# EAGLE design PracticalArduino_ProtoShieldPro (EAGLE 5.06)
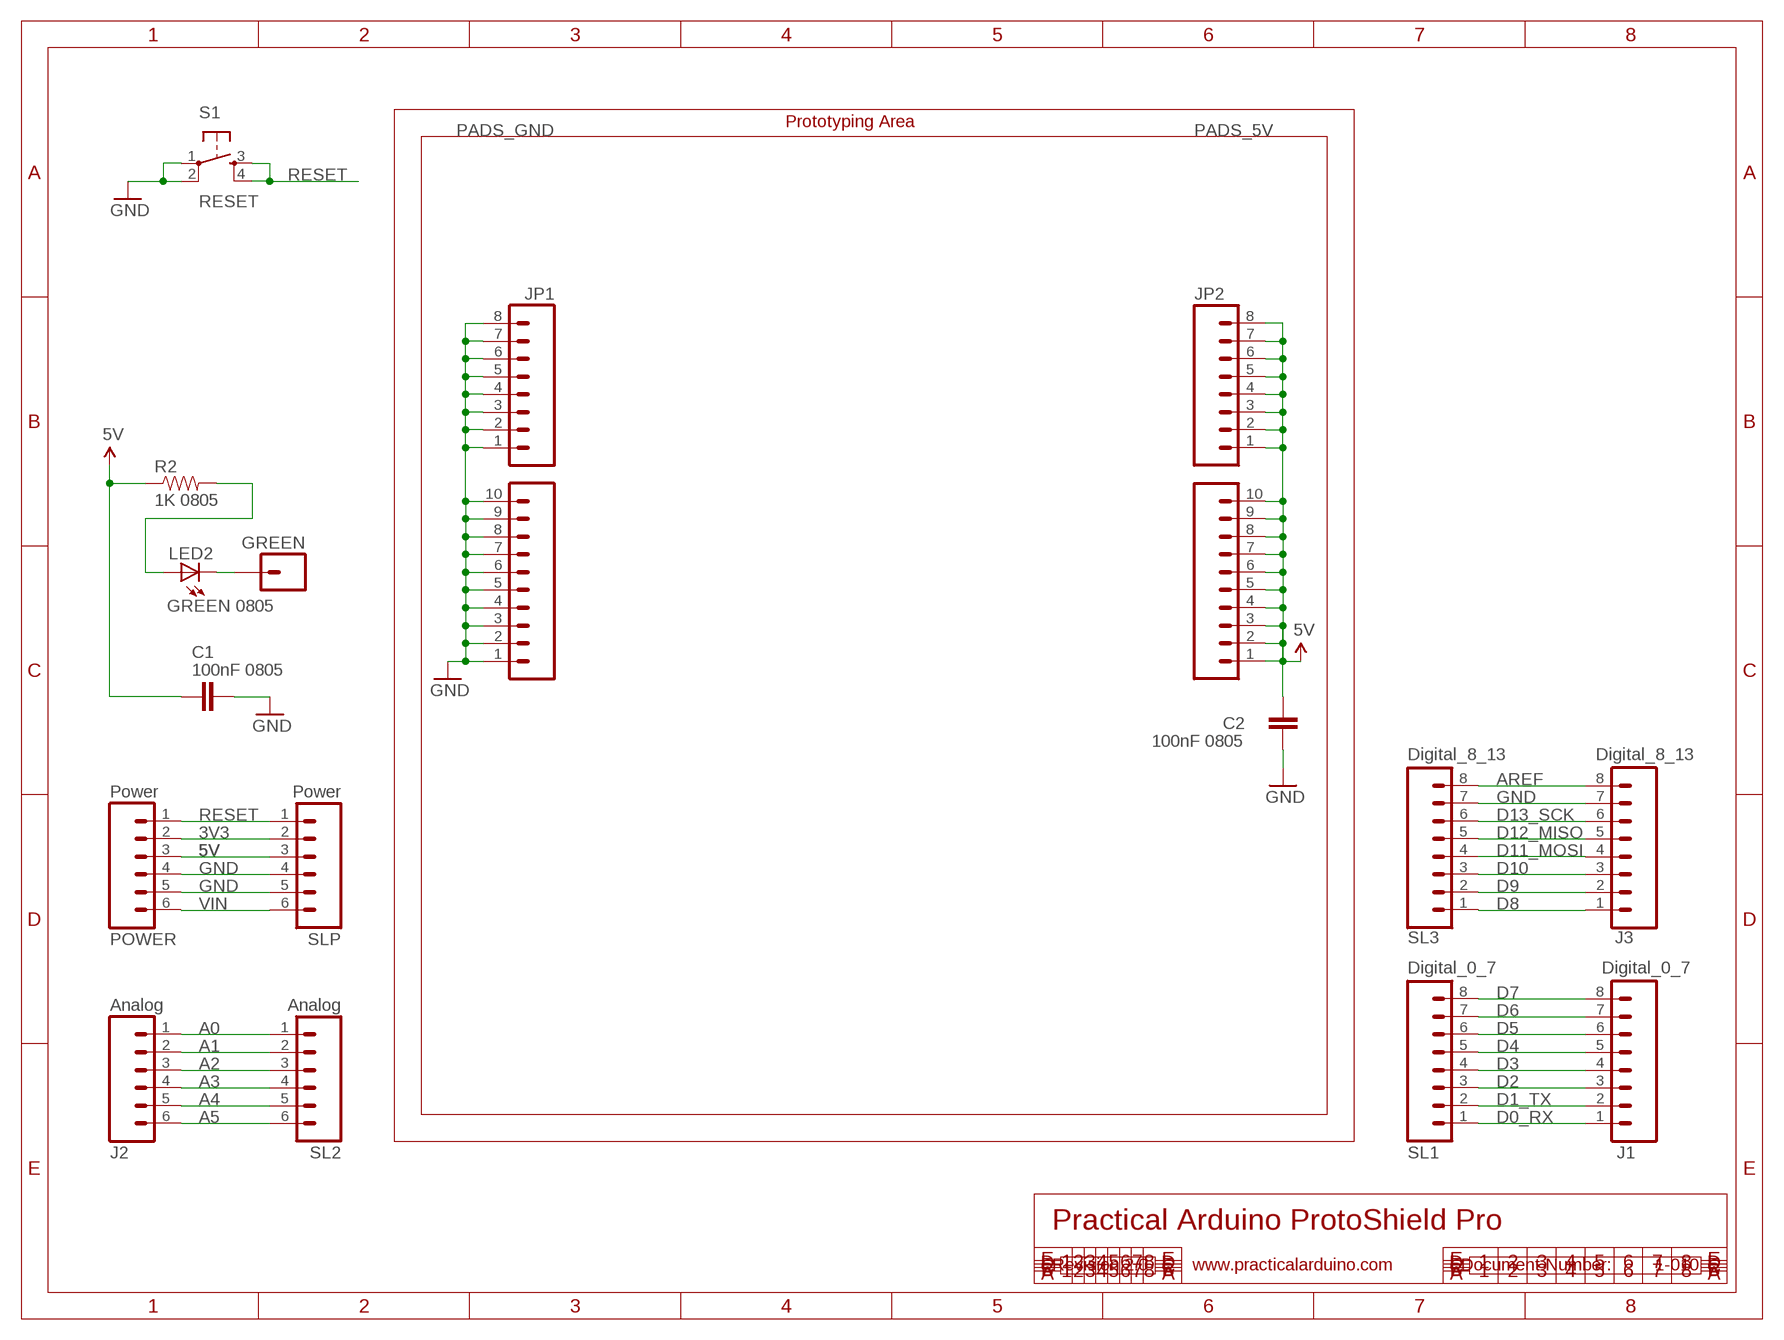
[diagram p0: schematic, sheet 1]

## Parts
C1  100nF 0805  CAP0805-LARGE  [0805-LARGE]
C2  100nF 0805  CAP0805-LARGE  [0805-LARGE]
GREEN  M01PTH  [1X01]
J1  Digital_0_7  M08  [1X08]
J2  Analog  M06SIP  [1X06]
J3  Digital_8_13  M08  [1X08]
JP1  M08  [1X08]
JP2  M08  [1X08]
LED2  GREEN 0805  LED0805-LARGE  [LED-0805-LARGE]
PADS_5V  M100.1  [1X10]
PADS_GND  M100.1  [1X10]
POWER  Power  M06SIP  [1X06]
R2  1K 0805  RESISTOR0805-LARGE  [0805-LARGE]
S1  RESET  TAC_SWITCHPTH  [TACTILE-PTH]
SL1  Digital_0_7  M08  [1X08]
SL2  Analog  M06SIP  [1X06]
SL3  Digital_8_13  M08  [1X08]
SLP  Power  M06SIP  [1X06]

## Nets
3V3: POWER.2 SLP.2
5V: C1.1 C2.1 JP2.1 JP2.2 JP2.3 JP2.4 JP2.5 JP2.6 JP2.7 JP2.8 PADS_5V.1 PADS_5V.2 PADS_5V.3 PADS_5V.4 PADS_5V.5 PADS_5V.6 PADS_5V.7 PADS_5V.8 PADS_5V.9 PADS_5V.10 POWER.3 R2.1 SLP.3
A0: J2.1 SL2.1
A1: J2.2 SL2.2
A2: J2.3 SL2.3
A3: J2.4 SL2.4
A4: J2.5 SL2.5
A5: J2.6 SL2.6
AREF: J3.8 SL3.8
D0_RX: J1.1 SL1.1
D1_TX: J1.2 SL1.2
D2: J1.3 SL1.3
D3: J1.4 SL1.4
D4: J1.5 SL1.5
D5: J1.6 SL1.6
D6: J1.7 SL1.7
D7: J1.8 SL1.8
D8: J3.1 SL3.1
D9: J3.2 SL3.2
D10: J3.3 SL3.3
D11_MOSI: J3.4 SL3.4
D12_MISO: J3.5 SL3.5
D13_SCK: J3.6 SL3.6
GND: C1.2 C2.2 J3.7 JP1.1 JP1.2 JP1.3 JP1.4 JP1.5 JP1.6 JP1.7 JP1.8 PADS_GND.1 PADS_GND.2 PADS_GND.3 PADS_GND.4 PADS_GND.5 PADS_GND.6 PADS_GND.7 PADS_GND.8 PADS_GND.9 PADS_GND.10 POWER.4 POWER.5 S1.1 S1.2 SL3.7 SLP.4 SLP.5
N$3: LED2.A R2.2
N$4: GREEN.1 LED2.C
RESET: POWER.1 S1.3 S1.4 SLP.1
VIN: POWER.6 SLP.6

## Notes on the sheet
- Prototyping Area
- Practical Arduino ProtoShield Pro
- Revision 2.0 | www.practicalarduino.com | Document Number: | 1-010

## Library data of the parts
C1 C2 = SparkFun:CAP: Capacitor Standard 0603 ceramic capacitor, and 0.1" leaded capacitor.
GREEN = SparkFun:M01: Header 1 Standard 1-pin 0.1" header. Use with straight break away headers (SKU : PRT-00116), right angle break away headers (PRT-00553), swiss pins (PRT-00743), machine pins (PRT-00117), and female headers (PRT-00115).
J1 J3 JP1 JP2 SL1 SL3 = SparkFun:M08: Header 8 Standard 8-pin 0.1" header. Use with straight break away headers (SKU : PRT-00116), right angle break away headers (PRT-00553), swiss pins (PRT-00743), machine pins (PRT-00117), and female headers (PRT-00115).
J2 POWER SL2 SLP = SparkFun:M06: Header 6 Standard 6-pin 0.1" header. Use with straight break away headers (SKU : PRT-00116), right angle break away headers (PRT-00553), swiss pins (PRT-00743), machine pins (PRT-00117), and female headers (PRT-00115). Molex polarized connector foot print use with SKU : PRT-08094 with associated crimp pins and housings. NOTES ON THE VARIANTS LOCK and LOCK_LONGPADS... This footprint was designed to help hold the alignment of a through-hole component (i.e. 6-pin header) while soldering it into place. You may notice that each hole has been shifted either up or down by 0.005 of an inch from it's more standard position (which is a perfectly straight line). This slight alteration caused the pins (the squares in the middle) to touch the edges of the holes. Because they are alternating, it causes a "brace" to hold the component in place. 0.005 has proven to be the perfect amount of "off-center" position when using our standard breakaway headers. Although looks a little odd when you look at the bare footprint, once you have a header in there, the alteration is very hard to notice. Also, if you push a header all the way into place, it is covered up entirely on the bottom side. This idea of altering the position of holes to aid alignment will be further integrated into the Sparkfun Library for other footprints. It can help hold any component with 3 or more connection pins.
LED2 = SparkFun:LED: LEDs Standard schematic elements and footprints for 5mm, 3mm, 1206, and 0603 sized LEDs. 5mm - Spark Fun Electronics SKU : COM-00529 (and others)
PADS_5V PADS_GND = SparkFun:M10: Header 10 Standard 10-pin 0.1" header. Use with straight break away headers (SKU : PRT-00116), right angle break away headers (PRT-00553), swiss pins (PRT-00743), machine pins (PRT-00117), and female headers (PRT-00115).
R2 = SparkFun:RESISTOR: Resistor Basic schematic elements and footprints for 0603, 1206, and PTH 1/10th watt (small) resistors.
S1 = SparkFun:TAC_SWITCH: Momentary Switch Button commonly used for reset or general input. Spark Fun Electronics SKU : COM-00097

## Board
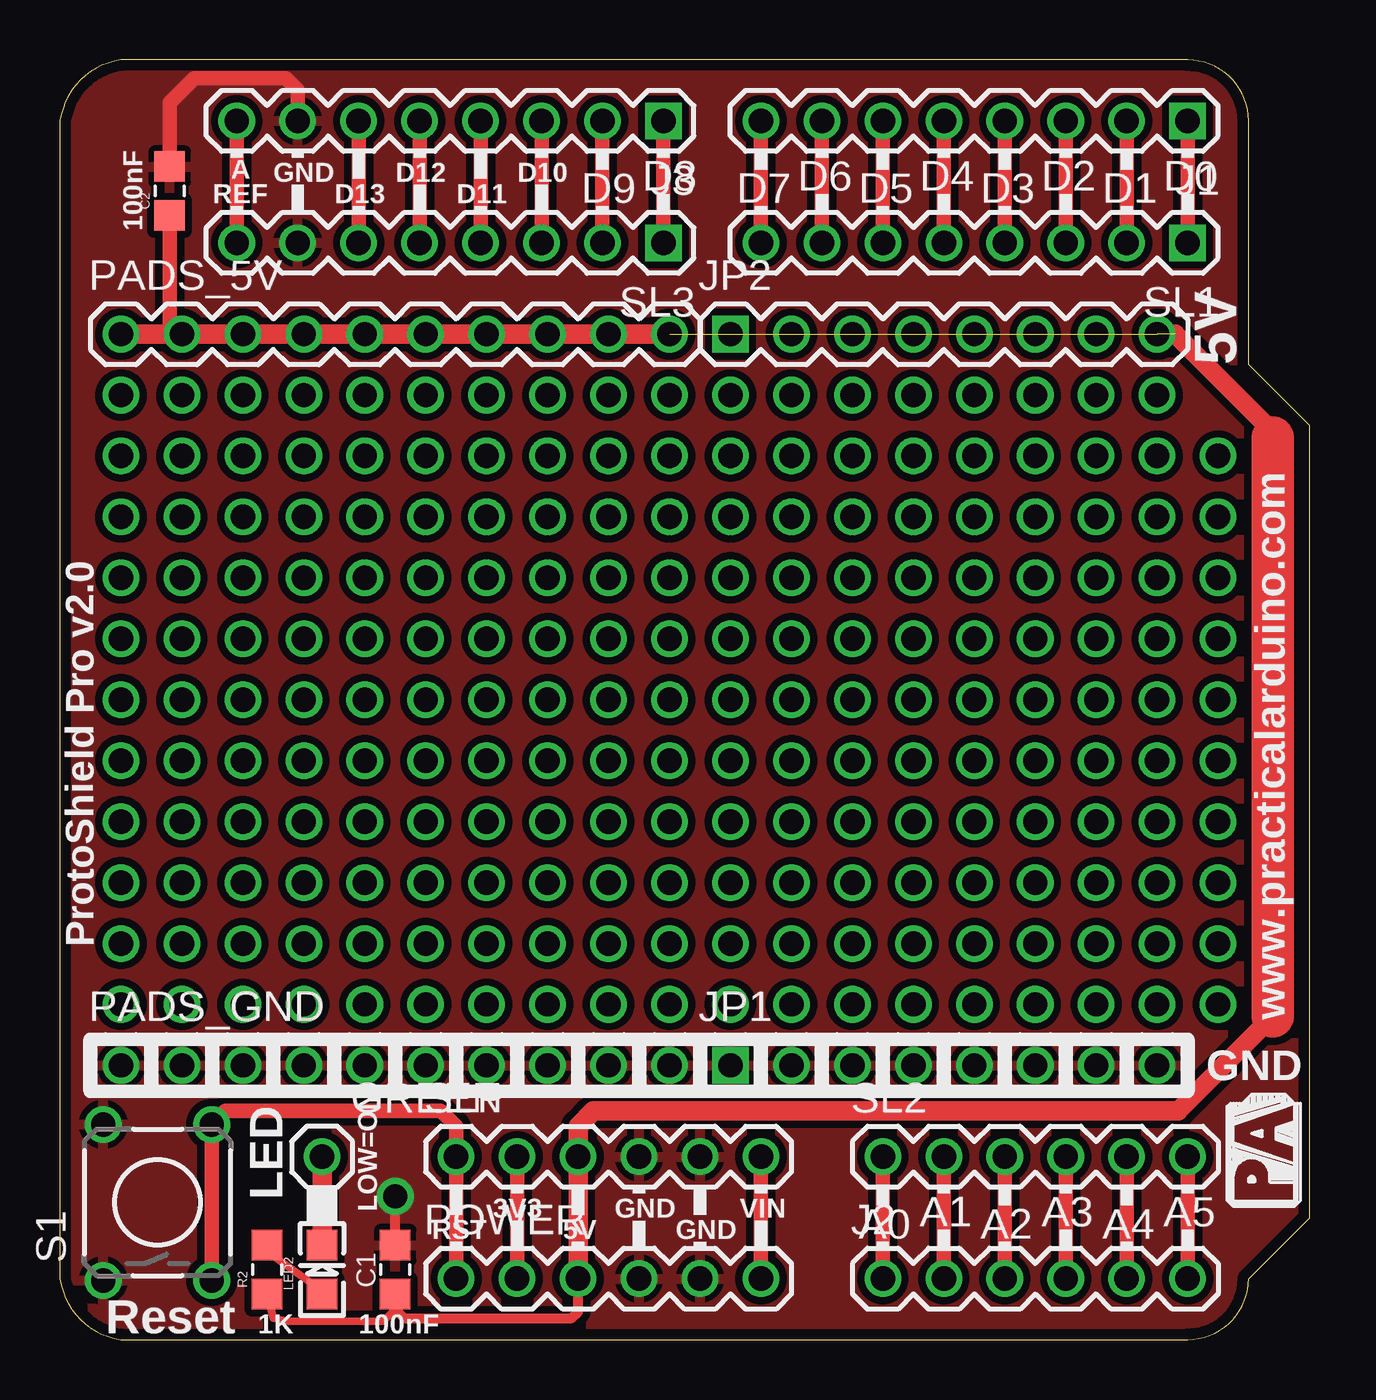
[diagram p1: board, top side]
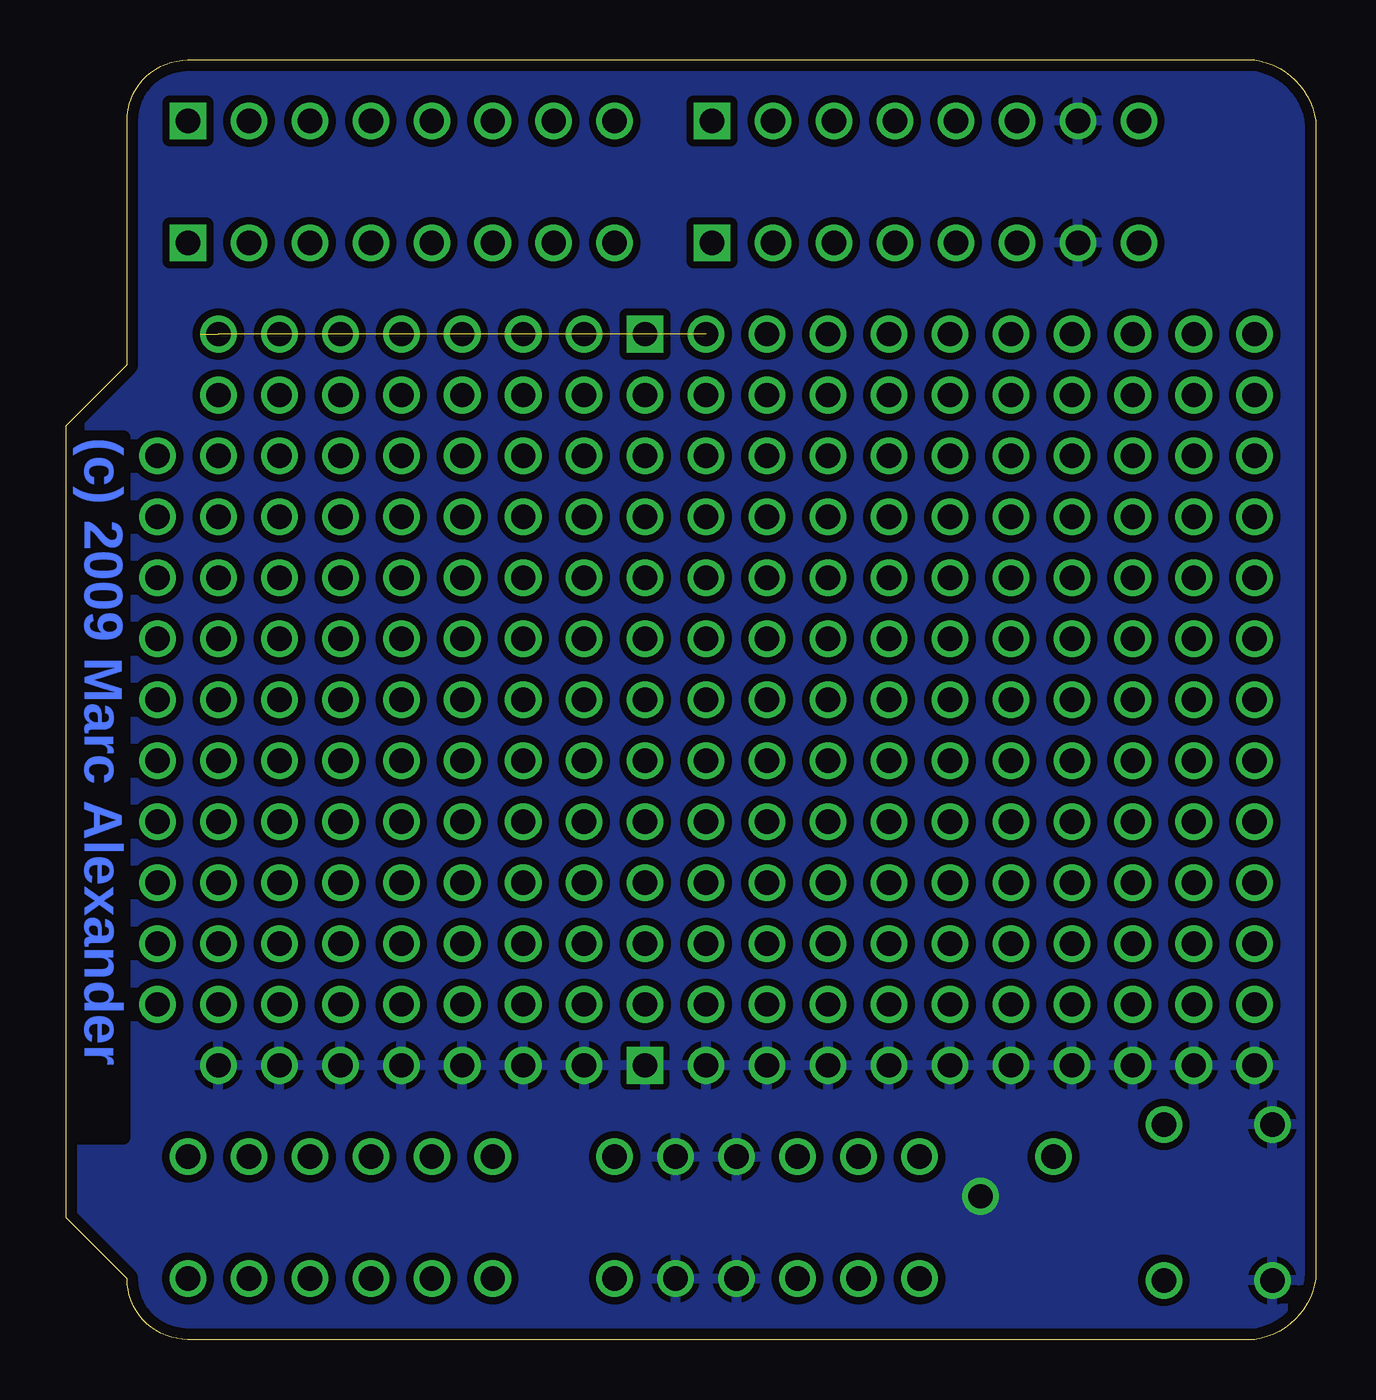
[diagram p2: board, bottom side, seen from below]

Size 52.07 x 53.34 mm. Coordinates in mm from the lower left corner, seen from the top.
Outline: 0,2.54 arc74 2.54,0 46.99,0 arc90 49.53,2.54 52.07,5.08 52.07,38.1 49.53,40.64 49.53,50.8 arc90 46.99,53.34 2.54,53.34 arc74 0,50.8 0,2.54
Copper layers (1*16): Top 0.035mm / dielectric 1.5mm / Bottom 0.035mm
Design rules "default *": minimum track width 10mil, minimum drill 24mil, track to track 12mil, track to pad 12mil, pad to pad 12mil, via to via 12mil, smd to smd 8mil, copper to edge 18mil, drill to drill 8mil, minimum pad ring 10mil, minimum via ring 8mil, stop-mask expansion 4mil, vias tented up to drill 0mil, thermal gap 10mil

### Footprints (pad centres in the part's own frame; a part is rotated, then mirrored left to right if it is on the bottom)
0805-LARGE = smd 1.27 x 1.27: 1 -1.016,0; 2 1.016,0
1X01 = drill 1.016 round: 1 0,0
1X08 = drill 1.016 square: 1 0,0 | drill 1.016 round: 2 2.54,0; 3 5.08,0; 4 7.62,0; 5 10.16,0; 6 12.7,0; 7 15.24,0; 8 17.78,0
1X06 = drill 1.016 round: 1 0,0; 2 2.54,0; 3 5.08,0; 4 7.62,0; 5 10.16,0; 6 12.7,0
LED-0805-LARGE = smd 1.27 x 1.27: A -1.016,0; C 1.016,0
1X10 = drill 1.016 round: 1 0,0; 2 2.54,0; 3 5.08,0; 4 7.62,0; 5 10.16,0; 6 12.7,0; 7 15.24,0; 8 17.78,0; 9 20.32,0; 10 22.86,0
TACTILE-PTH = drill 1.016 round: 1 -3.251,2.261; 2 3.251,2.261; 3 -3.251,-2.261; 4 3.251,-2.261

### Placement (x,y rotation side)
C1  13.97,2.92 90 top
C2  4.57,47.88 90 top
GREEN  10.92,7.62 0 top
J1  46.99,50.8 180 top
J2  34.29,2.54 0 top
J3  25.15,50.8 180 top
JP1  27.94,11.43 0 top
JP2  27.94,41.91 0 top
LED2  10.92,2.92 90 top
PADS_5V  2.54,41.91 0 top
PADS_GND  2.54,11.43 0 top
POWER  16.51,2.54 0 top
R2  8.64,2.92 90 top
S1  4.06,5.71 90 top
SL1  46.99,45.72 180 top
SL2  34.29,7.62 0 top
SL3  25.15,45.72 180 top
SLP  16.51,7.62 0 top
U$4  [PRACTICALARDUINO-LOGO]  51.69,5.54 90 top

### Tracks (layer width: path | path; a pad name or v marks a point on that pad's centre or on a via)
3V3
  Top 0.61: POWER.2 SLP.2
5V  (9 unrouted)
  Top 0.305: 13.97,1.27 13.46,0.76 9.53,0.76 8.89,0.89 R2.1
  Top 0.406: POWER.3 21.59,1.14 21.34,0.89 14.35,0.89 13.97,1.27 C1.1
  Top 0.61: 4.57,41.91 C2.1
  Top 0.813: POWER.3 SLP.3 21.59,8.89 22.23,9.53 46.61,9.53 50.55,13.46 | 50.55,37.59 50.55,37.85 46.48,41.91 | PADS_5V.1 4.57,41.91 PADS_5V.2 PADS_5V.3 PADS_5V.4 PADS_5V.5 PADS_5V.6 PADS_5V.7 PADS_5V.8 PADS_5V.9 PADS_5V.10
  Top 1.778: 50.55,13.46 50.55,37.59
A0
  Top 0.61: J2.1 SL2.1
A1
  Top 0.61: J2.2 SL2.2
A2
  Top 0.61: J2.3 SL2.3
A3
  Top 0.61: J2.4 SL2.4
A4
  Top 0.61: J2.5 SL2.5
A5
  Top 0.61: J2.6 SL2.6
AREF
  Top 0.61: SL3.8 J3.8
D0_RX
  Top 0.61: SL1.1 J1.1
D1_TX
  Top 0.61: SL1.2 J1.2
D2
  Top 0.61: SL1.3 J1.3
D3
  Top 0.61: SL1.4 J1.4
D4
  Top 0.61: SL1.5 J1.5
D5
  Top 0.61: SL1.6 J1.6
D6
  Top 0.61: SL1.7 J1.7
D7
  Top 0.61: SL1.8 J1.8
D8
  Top 0.61: SL3.1 J3.1
D9
  Top 0.61: SL3.2 J3.2
D10
  Top 0.61: SL3.3 J3.3
D11_MOSI
  Top 0.61: SL3.4 J3.4
D12_MISO
  Top 0.61: SL3.5 J3.5
D13_SCK
  Top 0.61: SL3.6 J3.6
GND  (via drill 1.02)
  Top 0.406: C1.2 v13.97,5.97
  Top 0.61: C2.2 4.57,51.56 5.59,52.58 9.4,52.58 9.91,52.07 J3.7
  pour Bottom: 0,50.8 arc-74 2.54,53.34 46.99,53.34 arc-74 49.53,50.8 49.53,40.64 52.07,38.1 52.07,5.08 49.53,2.54 arc-74 46.99,0 2.54,0 arc-74 0,2.54
  pour Top: 0,50.8 arc-74 2.54,53.34 46.99,53.34 arc-74 49.53,50.8 49.53,40.64 52.07,38.1 52.07,5.08 49.53,2.54 arc-74 46.99,0 2.54,0 arc-74 0,2.54
N$3
  Top 0.305: R2.2 8.26,3.94 10.92,2.03 10.79,1.78 LED2.A
N$4
  Top 0.813: LED2.C GREEN.1
N$5  (via drill 1.02)
  other vias: 43.18,13.97
N$7  (via drill 1.02)
  other vias: 40.64,13.97
N$8  (via drill 1.02)
  other vias: 38.1,13.97
N$9  (via drill 1.02)
  other vias: 35.56,13.97
N$10  (via drill 1.02)
  other vias: 33.02,13.97
N$11  (via drill 1.02)
  other vias: 30.48,13.97
N$12  (via drill 1.02)
  other vias: 27.94,13.97
N$13  (via drill 1.02)
  other vias: 25.4,13.97
N$14  (via drill 1.02)
  other vias: 22.86,13.97
N$15  (via drill 1.02)
  other vias: 20.32,13.97
N$16  (via drill 1.02)
  other vias: 17.78,13.97
N$17  (via drill 1.02)
  other vias: 15.24,13.97
N$18  (via drill 1.02)
  other vias: 12.7,13.97
N$19  (via drill 1.02)
  other vias: 10.16,13.97
N$20  (via drill 1.02)
  other vias: 7.62,13.97
N$21  (via drill 1.02)
  other vias: 5.08,13.97
N$22  (via drill 1.02)
  other vias: 43.18,16.51
N$23  (via drill 1.02)
  other vias: 40.64,16.51
N$24  (via drill 1.02)
  other vias: 38.1,16.51
N$25  (via drill 1.02)
  other vias: 35.56,16.51
N$26  (via drill 1.02)
  other vias: 33.02,16.51
N$27  (via drill 1.02)
  other vias: 30.48,16.51
N$28  (via drill 1.02)
  other vias: 27.94,16.51
N$29  (via drill 1.02)
  other vias: 25.4,16.51
N$30  (via drill 1.02)
  other vias: 22.86,16.51
N$31  (via drill 1.02)
  other vias: 20.32,16.51
N$32  (via drill 1.02)
  other vias: 17.78,16.51
N$33  (via drill 1.02)
  other vias: 15.24,16.51
N$34  (via drill 1.02)
  other vias: 12.7,16.51
N$35  (via drill 1.02)
  other vias: 10.16,16.51
N$36  (via drill 1.02)
  other vias: 7.62,16.51
N$37  (via drill 1.02)
  other vias: 5.08,16.51
N$38  (via drill 1.02)
  other vias: 43.18,19.05
N$39  (via drill 1.02)
  other vias: 40.64,19.05
N$40  (via drill 1.02)
  other vias: 38.1,19.05
N$41  (via drill 1.02)
  other vias: 35.56,19.05
N$42  (via drill 1.02)
  other vias: 33.02,19.05
N$43  (via drill 1.02)
  other vias: 30.48,19.05
N$44  (via drill 1.02)
  other vias: 27.94,19.05
N$45  (via drill 1.02)
  other vias: 25.4,19.05
N$46  (via drill 1.02)
  other vias: 22.86,19.05
N$47  (via drill 1.02)
  other vias: 20.32,19.05
N$48  (via drill 1.02)
  other vias: 17.78,19.05
N$49  (via drill 1.02)
  other vias: 15.24,19.05
N$50  (via drill 1.02)
  other vias: 12.7,19.05
N$51  (via drill 1.02)
  other vias: 10.16,19.05
N$52  (via drill 1.02)
  other vias: 7.62,19.05
N$53  (via drill 1.02)
  other vias: 5.08,19.05
N$54  (via drill 1.02)
  other vias: 43.18,21.59
N$55  (via drill 1.02)
  other vias: 40.64,21.59
N$56  (via drill 1.02)
  other vias: 38.1,21.59
N$57  (via drill 1.02)
  other vias: 35.56,21.59
N$58  (via drill 1.02)
  other vias: 33.02,21.59
N$59  (via drill 1.02)
  other vias: 30.48,21.59
N$60  (via drill 1.02)
  other vias: 27.94,21.59
N$61  (via drill 1.02)
  other vias: 25.4,21.59
N$62  (via drill 1.02)
  other vias: 22.86,21.59
N$63  (via drill 1.02)
  other vias: 20.32,21.59
N$64  (via drill 1.02)
  other vias: 17.78,21.59
N$65  (via drill 1.02)
  other vias: 15.24,21.59
N$66  (via drill 1.02)
  other vias: 12.7,21.59
N$67  (via drill 1.02)
  other vias: 10.16,21.59
N$68  (via drill 1.02)
  other vias: 7.62,21.59
N$69  (via drill 1.02)
  other vias: 5.08,21.59
N$70  (via drill 1.02)
  other vias: 43.18,24.13
N$71  (via drill 1.02)
  other vias: 40.64,24.13
N$72  (via drill 1.02)
  other vias: 38.1,24.13
N$73  (via drill 1.02)
  other vias: 35.56,24.13
N$74  (via drill 1.02)
  other vias: 33.02,24.13
N$75  (via drill 1.02)
  other vias: 30.48,24.13
N$76  (via drill 1.02)
  other vias: 27.94,24.13
N$77  (via drill 1.02)
  other vias: 25.4,24.13
N$78  (via drill 1.02)
  other vias: 22.86,24.13
N$79  (via drill 1.02)
  other vias: 20.32,24.13
N$80  (via drill 1.02)
  other vias: 17.78,24.13
N$81  (via drill 1.02)
  other vias: 15.24,24.13
N$82  (via drill 1.02)
  other vias: 12.7,24.13
N$83  (via drill 1.02)
  other vias: 10.16,24.13
N$84  (via drill 1.02)
  other vias: 7.62,24.13
N$85  (via drill 1.02)
  other vias: 5.08,24.13
N$86  (via drill 1.02)
  other vias: 43.18,26.67
N$87  (via drill 1.02)
  other vias: 40.64,26.67
N$88  (via drill 1.02)
  other vias: 38.1,26.67
N$89  (via drill 1.02)
  other vias: 35.56,26.67
N$90  (via drill 1.02)
  other vias: 33.02,26.67
N$91  (via drill 1.02)
  other vias: 30.48,26.67
N$92  (via drill 1.02)
  other vias: 27.94,26.67
N$93  (via drill 1.02)
  other vias: 25.4,26.67
N$94  (via drill 1.02)
  other vias: 22.86,26.67
N$95  (via drill 1.02)
  other vias: 20.32,26.67
N$96  (via drill 1.02)
  other vias: 17.78,26.67
N$97  (via drill 1.02)
  other vias: 15.24,26.67
N$98  (via drill 1.02)
  other vias: 12.7,26.67
N$99  (via drill 1.02)
  other vias: 10.16,26.67
N$100  (via drill 1.02)
  other vias: 7.62,26.67
N$101  (via drill 1.02)
  other vias: 5.08,26.67
N$102  (via drill 1.02)
  other vias: 43.18,29.21
N$103  (via drill 1.02)
  other vias: 40.64,29.21
N$104  (via drill 1.02)
  other vias: 38.1,29.21
N$105  (via drill 1.02)
  other vias: 35.56,29.21
N$106  (via drill 1.02)
  other vias: 33.02,29.21
N$107  (via drill 1.02)
  other vias: 30.48,29.21
N$108  (via drill 1.02)
  other vias: 27.94,29.21
N$109  (via drill 1.02)
  other vias: 25.4,29.21
N$110  (via drill 1.02)
  other vias: 22.86,29.21
N$111  (via drill 1.02)
  other vias: 20.32,29.21
N$112  (via drill 1.02)
  other vias: 17.78,29.21
N$113  (via drill 1.02)
  other vias: 15.24,29.21
N$114  (via drill 1.02)
  other vias: 12.7,29.21
N$115  (via drill 1.02)
  other vias: 10.16,29.21
N$116  (via drill 1.02)
  other vias: 7.62,29.21
N$117  (via drill 1.02)
  other vias: 5.08,29.21
N$118  (via drill 1.02)
  other vias: 43.18,31.75
N$119  (via drill 1.02)
  other vias: 40.64,31.75
N$120  (via drill 1.02)
  other vias: 38.1,31.75
N$121  (via drill 1.02)
  other vias: 35.56,31.75
N$122  (via drill 1.02)
  other vias: 33.02,31.75
N$123  (via drill 1.02)
  other vias: 30.48,31.75
N$124  (via drill 1.02)
  other vias: 27.94,31.75
N$125  (via drill 1.02)
  other vias: 25.4,31.75
N$126  (via drill 1.02)
  other vias: 22.86,31.75
N$127  (via drill 1.02)
  other vias: 20.32,31.75
N$128  (via drill 1.02)
  other vias: 17.78,31.75
N$129  (via drill 1.02)
  other vias: 15.24,31.75
N$130  (via drill 1.02)
  other vias: 12.7,31.75
N$131  (via drill 1.02)
  other vias: 10.16,31.75
N$132  (via drill 1.02)
  other vias: 7.62,31.75
N$133  (via drill 1.02)
  other vias: 5.08,31.75
N$134  (via drill 1.02)
  other vias: 43.18,34.29
N$135  (via drill 1.02)
  other vias: 40.64,34.29
N$136  (via drill 1.02)
  other vias: 38.1,34.29
N$137  (via drill 1.02)
  other vias: 35.56,34.29
N$138  (via drill 1.02)
  other vias: 33.02,34.29
N$139  (via drill 1.02)
  other vias: 30.48,34.29
N$140  (via drill 1.02)
  other vias: 27.94,34.29
N$141  (via drill 1.02)
  other vias: 25.4,34.29
N$142  (via drill 1.02)
  other vias: 22.86,34.29
N$143  (via drill 1.02)
  other vias: 20.32,34.29
N$144  (via drill 1.02)
  other vias: 17.78,34.29
N$145  (via drill 1.02)
  other vias: 15.24,34.29
N$146  (via drill 1.02)
  other vias: 12.7,34.29
N$147  (via drill 1.02)
  other vias: 10.16,34.29
N$148  (via drill 1.02)
  other vias: 7.62,34.29
N$149  (via drill 1.02)
  other vias: 5.08,34.29
N$150  (via drill 1.02)
  other vias: 43.18,36.83
N$151  (via drill 1.02)
  other vias: 40.64,36.83
N$152  (via drill 1.02)
  other vias: 38.1,36.83
N$153  (via drill 1.02)
  other vias: 35.56,36.83
N$154  (via drill 1.02)
  other vias: 33.02,36.83
N$155  (via drill 1.02)
  other vias: 30.48,36.83
N$156  (via drill 1.02)
  other vias: 27.94,36.83
N$157  (via drill 1.02)
  other vias: 25.4,36.83
N$158  (via drill 1.02)
  other vias: 22.86,36.83
N$159  (via drill 1.02)
  other vias: 20.32,36.83
N$160  (via drill 1.02)
  other vias: 17.78,36.83
N$161  (via drill 1.02)
  other vias: 15.24,36.83
N$162  (via drill 1.02)
  other vias: 12.7,36.83
N$163  (via drill 1.02)
  other vias: 10.16,36.83
N$164  (via drill 1.02)
  other vias: 7.62,36.83
N$165  (via drill 1.02)
  other vias: 5.08,36.83
N$166  (via drill 1.02)
  other vias: 43.18,39.37
N$167  (via drill 1.02)
  other vias: 40.64,39.37
N$168  (via drill 1.02)
  other vias: 38.1,39.37
N$169  (via drill 1.02)
  other vias: 35.56,39.37
N$170  (via drill 1.02)
  other vias: 33.02,39.37
N$171  (via drill 1.02)
  other vias: 30.48,39.37
N$172  (via drill 1.02)
  other vias: 27.94,39.37
N$173  (via drill 1.02)
  other vias: 25.4,39.37
N$174  (via drill 1.02)
  other vias: 22.86,39.37
N$175  (via drill 1.02)
  other vias: 20.32,39.37
N$176  (via drill 1.02)
  other vias: 17.78,39.37
N$177  (via drill 1.02)
  other vias: 15.24,39.37
N$178  (via drill 1.02)
  other vias: 12.7,39.37
N$179  (via drill 1.02)
  other vias: 10.16,39.37
N$180  (via drill 1.02)
  other vias: 7.62,39.37
N$181  (via drill 1.02)
  other vias: 5.08,39.37
N$182  (via drill 1.02)
  other vias: 45.72,13.97
N$183  (via drill 1.02)
  other vias: 45.72,16.51
N$184  (via drill 1.02)
  other vias: 45.72,19.05
N$185  (via drill 1.02)
  other vias: 45.72,21.59
N$186  (via drill 1.02)
  other vias: 45.72,24.13
N$187  (via drill 1.02)
  other vias: 45.72,26.67
N$188  (via drill 1.02)
  other vias: 45.72,29.21
N$189  (via drill 1.02)
  other vias: 45.72,31.75
N$190  (via drill 1.02)
  other vias: 45.72,34.29
N$191  (via drill 1.02)
  other vias: 45.72,36.83
N$192  (via drill 1.02)
  other vias: 45.72,39.37
N$193  (via drill 1.02)
  other vias: 48.26,13.97
N$194  (via drill 1.02)
  other vias: 48.26,16.51
N$195  (via drill 1.02)
  other vias: 48.26,19.05
N$196  (via drill 1.02)
  other vias: 48.26,21.59
N$197  (via drill 1.02)
  other vias: 48.26,24.13
N$198  (via drill 1.02)
  other vias: 48.26,26.67
N$199  (via drill 1.02)
  other vias: 48.26,29.21
N$200  (via drill 1.02)
  other vias: 48.26,31.75
N$201  (via drill 1.02)
  other vias: 48.26,34.29
N$202  (via drill 1.02)
  other vias: 48.26,36.83
N$204  (via drill 1.02)
  other vias: 2.54,13.97
N$205  (via drill 1.02)
  other vias: 2.54,16.51
N$206  (via drill 1.02)
  other vias: 2.54,19.05
N$207  (via drill 1.02)
  other vias: 2.54,21.59
N$208  (via drill 1.02)
  other vias: 2.54,24.13
N$209  (via drill 1.02)
  other vias: 2.54,26.67
N$210  (via drill 1.02)
  other vias: 2.54,29.21
N$211  (via drill 1.02)
  other vias: 2.54,31.75
N$212  (via drill 1.02)
  other vias: 2.54,34.29
N$213  (via drill 1.02)
  other vias: 2.54,36.83
N$214  (via drill 1.02)
  other vias: 2.54,39.37
RESET
  Top 0.61: SLP.1 POWER.1 SLP.1 | SLP.1 16.51,8.89 15.88,9.53 6.88,9.53 S1.4 S1.3
VIN
  Top 0.61: POWER.6 SLP.6

### Text on the board
Bottom: (c) 2009 Marc Alexander
tPlace: A | GND | D12 | D10 | D8 | D6 | D4 | D2 | D0 | REF | D13 | D11 | D9 | D7 | D5 | D3 | D1 | 100nF | 5V | ProtoShield Pro v2.0 | www.practicalarduino.com | GND | LED | LOW=ON | 3V3 | GND | VIN | A1 | A3 | A5 | RST | 5V | GND | A0 | A2 | A4 | Reset | 1K | 100nF